# Altium project ADCS ARM.PrjPcb
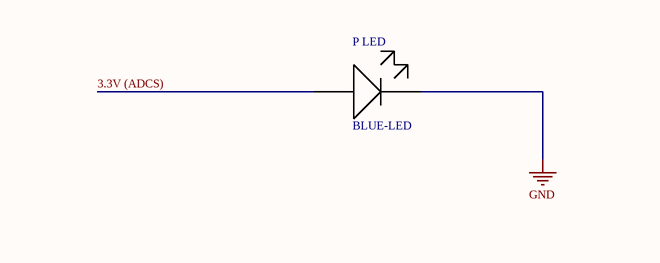
[diagram p0: ADCS ARM.SchDoc, top left]
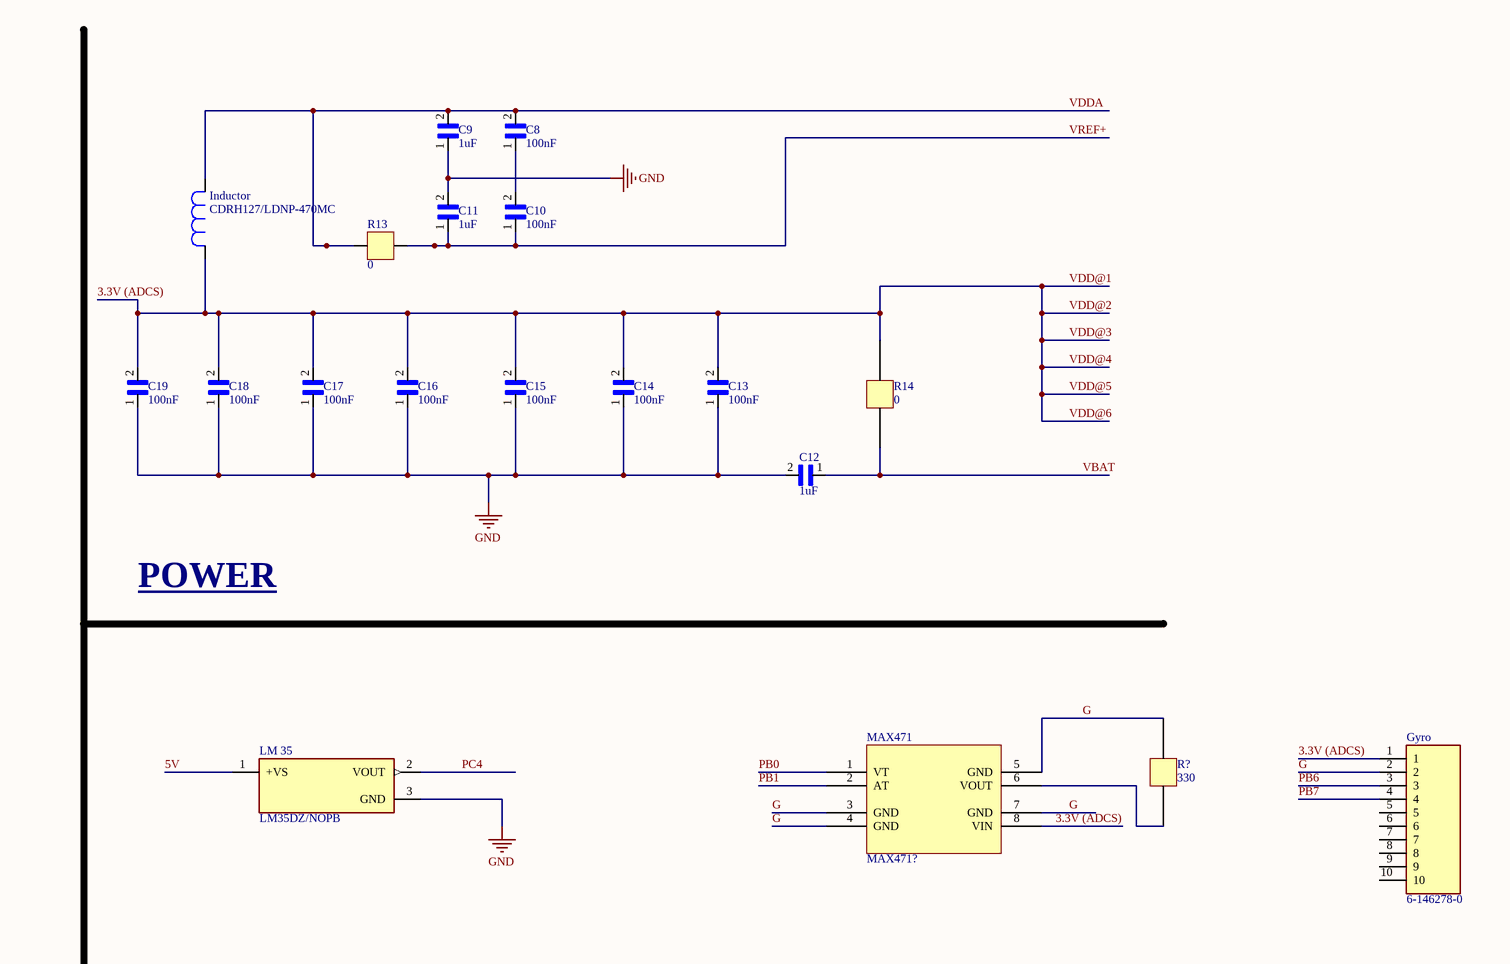
[diagram p1: ADCS ARM.SchDoc, top right]
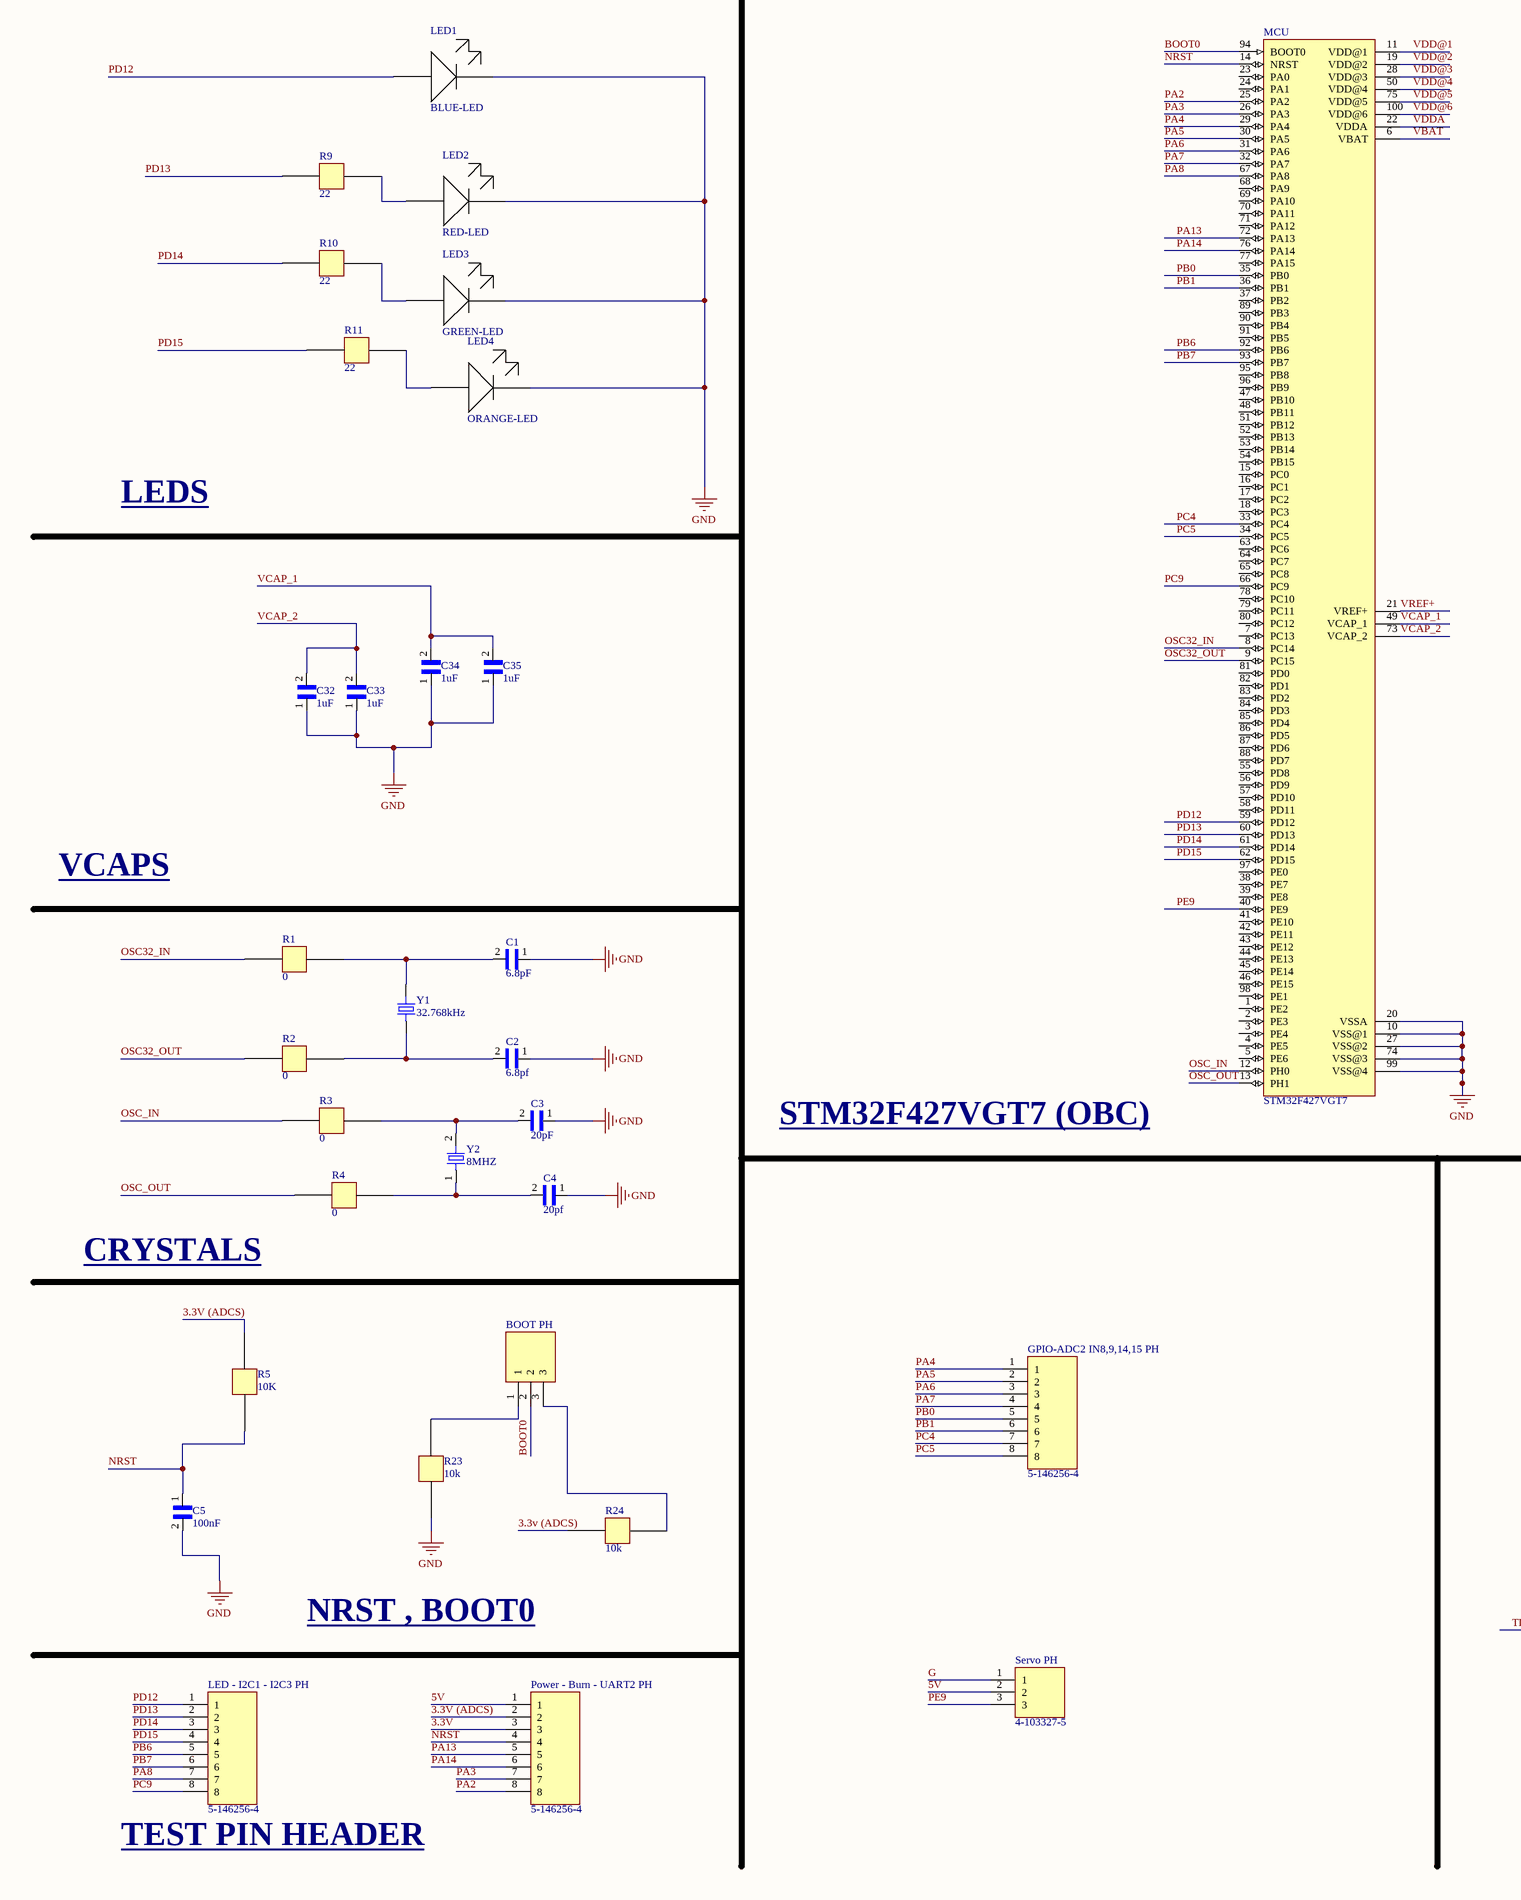
[diagram p2: ADCS ARM.SchDoc, bottom left]
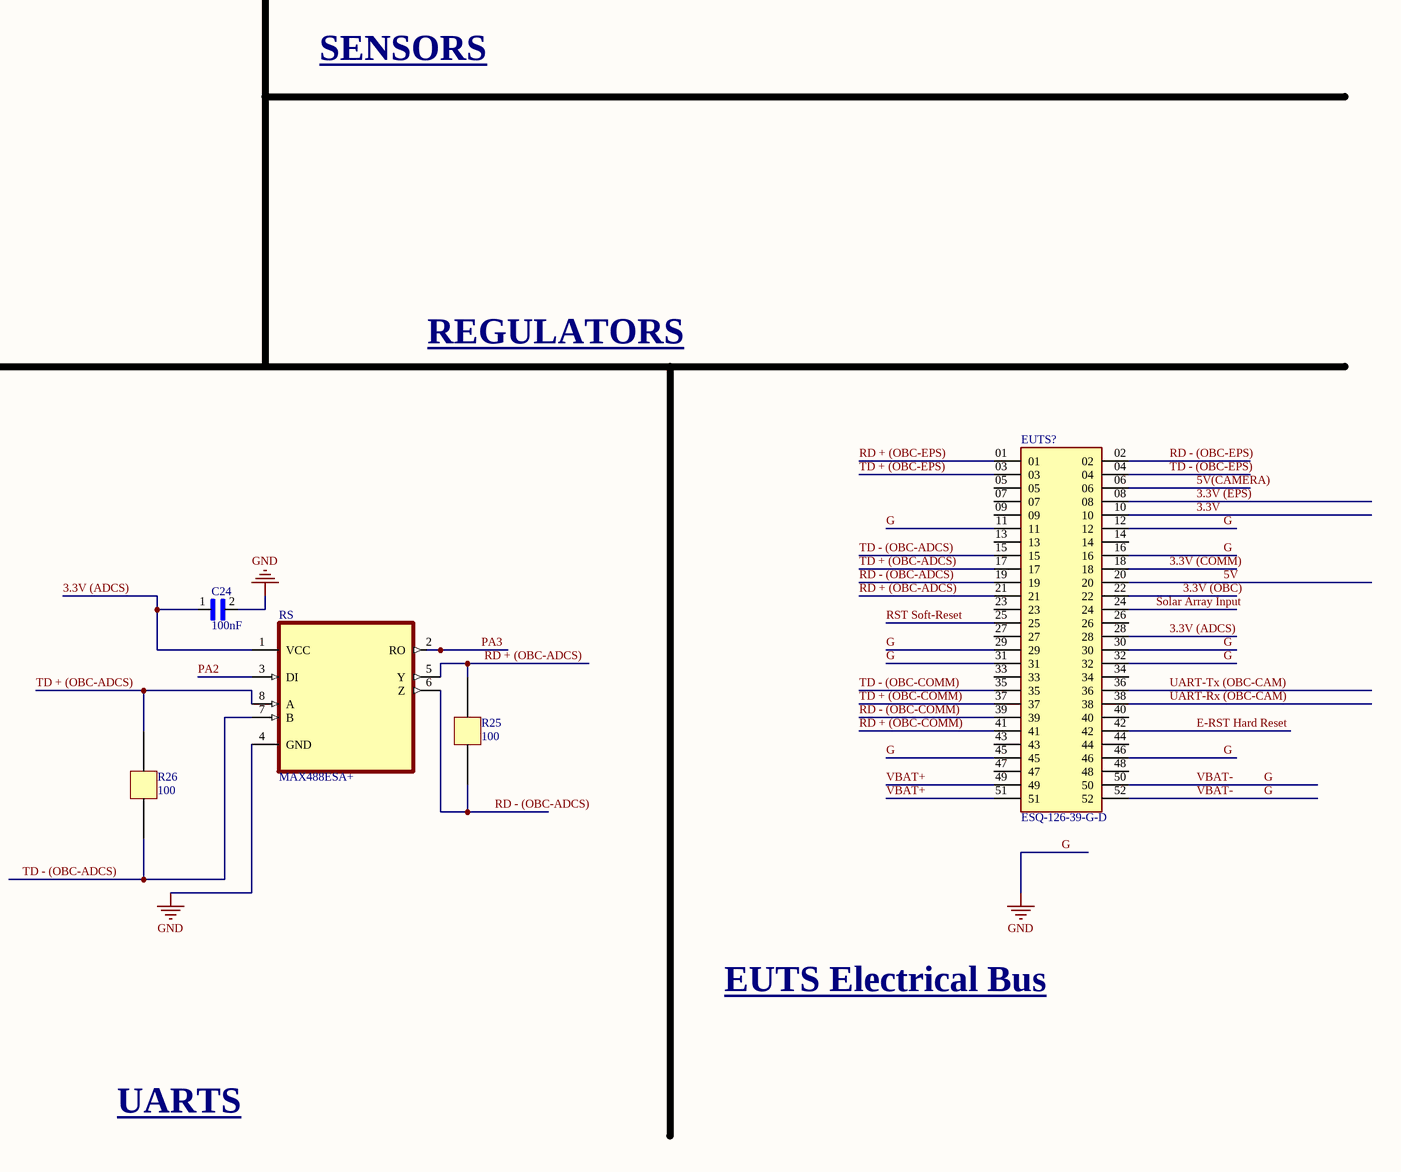
[diagram p3: ADCS ARM.SchDoc, bottom right]
1 sheet, 56 parts. Net scope: global (net labels, ports and power ports of the same name join across sheets).
Board file: ADCS ARM EUTS.PcbDoc

## Sheet ADCS ARM.SchDoc
size A1; SheetNumber: 1; SheetTotal: 1

### Parts
BOOT_PH  4-103327-5  [TE_4-103327-5]  (value not drawn)
C1  6.8pF  [CAPC2012X95N]
C2  6.8pf  [CAPC2012X95N]
C3  20pF  [CAPC2012X95N]
C4  20pf  [CAPC2012X95N]
C5  100nF  [CAPC2012X95N]
C8  100nF  [CAPC2012X95N]
C9  1uF  [CAPC2012X95N]
C10  100nF  [CAPC2012X95N]
C11  1uF  [CAPC2012X95N]
C12  1uF  [CAPC2012X95N]
C13  100nF  [CAPC2012X95N]
C14  100nF  [CAPC2012X95N]
C15  100nF  [CAPC2012X95N]
C16  100nF  [CAPC2012X95N]
C17  100nF  [CAPC2012X95N]
C18  100nF  [CAPC2012X95N]
C19  100nF  [CAPC2012X95N]
C24  100nF  [CAPC2012X95N]
C32  1uF  [CAPC2012X95N]
C33  1uF  [CAPC2012X95N]
C34  1uF  [CAPC2012X95N]
C35  1uF  [CAPC2012X95N]
EUTS?  ESQ-126-39-G-D  [SAMTEC_ESQ-126-39-G-D]
GPIO-ADC2_IN8,9,14,15_PH  5-146256-4  [TE_5-146256-4]
Gyro  6-146278-0  [TE_6-146278-0]
Inductor  CDRH127/LDNP-470MC  [IND_CDRH127/LDNP-470MC_SUM]
LED1  BLUE-LED  [RESC3015X65]
LED2  RED-LED  [RESC3015X65]
LED3  GREEN-LED  [RESC3015X65]
LED4  ORANGE-LED  [RESC3015X65]
LED_-_I2C1_-_I2C3_PH  5-146256-4  [TE_5-146256-4]
LM_35  LM35DZ/NOPB  [TO92127P521H735-3]
MAX471  MAX471?  [PCBComponent_1]
MCU  STM32F427VGT7  [QFP50P1600X1600X160-100N]
P_LED  BLUE-LED  [RESC3015X65]
Power_-_Burn_-_UART2_PH  5-146256-4  [TE_5-146256-4]
R1  0  [CAPC2012X95N]
R2  0  [CAPC2012X95N]
R3  0  [CAPC2012X95N]
R4  0  [CAPC2012X95N]
R5  10K  [CAPC2012X95N]
R9  22  [CAPC2012X95N]
R10  22  [CAPC2012X95N]
R11  22  [CAPC2012X95N]
R13  0  [CAPC2012X95N]
R14  0  [CAPC2012X95N]
R23  10k  [CAPC2012X95N]
R24  10k  [CAPC2012X95N]
R25  100  [CAPC2012X95N]
R26  100  [CAPC2012X95N]
R?  330  [CAPC2012X95N]
RS  MAX488ESA+  [SOIC127P600X175-8N]
Servo_PH  4-103327-5  [TE_4-103327-5]
Y1  32.768kHz  [XTAL_ECS-.327-12.5-34S-TR]
Y2  8MHZ  [XTAL500X320X130N]

### Nets
G: C1.1 C2.1 C3.1 C4.1 C5.2 C9.1 C11.2 C12.2 C13.1 C14.1 C15.1 C16.1 C17.1 C18.1 C19.1 C24.2 C32.1 C33.1 C34.1 C35.1 EUTS?.11 EUTS?.12 EUTS?.16 EUTS?.29 EUTS?.30 EUTS?.31 EUTS?.32 EUTS?.45 EUTS?.46 EUTS?.50 EUTS?.52 Gyro.2 LED1.2 LED2.2 LED3.2 LED4.2 LM_35.3(GND) MAX471.3(GND) MAX471.4(GND) MAX471.5(GND) MAX471.7(GND) MCU.10(VSS@1) MCU.20(VSSA) MCU.27(VSS@2) MCU.74(VSS@3) MCU.99(VSS@4) P_LED.2 R23.2 R?.1 RS.4(GND) Servo_PH.1  [also labelled GND, VBAT-]
3.3V: EUTS?.10 Power_-_Burn_-_UART2_PH.3
3.3V (ADCS): C13.2 C14.2 C15.2 C16.2 C17.2 C18.2 C19.2 C24.1 EUTS?.28 Gyro.1 Inductor.2 MAX471.8(VIN) MCU.11(VDD@1) MCU.19(VDD@2) MCU.28(VDD@3) MCU.50(VDD@4) MCU.75(VDD@5) MCU.100(VDD@6) P_LED.1 Power_-_Burn_-_UART2_PH.2 R5.1 R14.1 R24.2 RS.1(VCC)  [also labelled VDD@1, VDD@2, VDD@3, VDD@4, VDD@5, VDD@6]
3.3V (COMM): EUTS?.18
3.3V (EPS): EUTS?.08
3.3V (OBC): EUTS?.22
5V: EUTS?.20 LM_35.1(+VS) Power_-_Burn_-_UART2_PH.1 Servo_PH.2
5V(CAMERA): EUTS?.06
BOOT0: BOOT_PH.2 MCU.94(BOOT0)
E-RST Hard Reset: EUTS?.42
NRST: C5.1 MCU.14(NRST) Power_-_Burn_-_UART2_PH.4 R5.2
OSC32_IN: MCU.8(PC14) R1.2
OSC32_OUT: MCU.9(PC15) R2.2
OSC_IN: MCU.12(PH0) R3.2
OSC_OUT: MCU.13(PH1) R4.2
PA2: MCU.25(PA2) Power_-_Burn_-_UART2_PH.8 RS.3(DI)
PA3: MCU.26(PA3) Power_-_Burn_-_UART2_PH.7 RS.2(RO)
PA4: GPIO-ADC2_IN8,9,14,15_PH.1 MCU.29(PA4)
PA5: GPIO-ADC2_IN8,9,14,15_PH.2 MCU.30(PA5)
PA6: GPIO-ADC2_IN8,9,14,15_PH.3 MCU.31(PA6)
PA7: GPIO-ADC2_IN8,9,14,15_PH.4 MCU.32(PA7)
PA8: LED_-_I2C1_-_I2C3_PH.7 MCU.67(PA8)
PA13: MCU.72(PA13) Power_-_Burn_-_UART2_PH.5
PA14: MCU.76(PA14) Power_-_Burn_-_UART2_PH.6
PB0: GPIO-ADC2_IN8,9,14,15_PH.5 MAX471.1(VT) MCU.35(PB0)
PB1: GPIO-ADC2_IN8,9,14,15_PH.6 MAX471.2(AT) MCU.36(PB1)
PB6: Gyro.3 LED_-_I2C1_-_I2C3_PH.5 MCU.92(PB6)
PB7: Gyro.4 LED_-_I2C1_-_I2C3_PH.6 MCU.93(PB7)
PC4: GPIO-ADC2_IN8,9,14,15_PH.7 LM_35.2(VOUT) MCU.33(PC4)
PC5: GPIO-ADC2_IN8,9,14,15_PH.8 MCU.34(PC5)
PC9: LED_-_I2C1_-_I2C3_PH.8 MCU.66(PC9)
PD12: LED1.1 LED_-_I2C1_-_I2C3_PH.1 MCU.59(PD12)
PD13: LED_-_I2C1_-_I2C3_PH.2 MCU.60(PD13) R9.2
PD14: LED_-_I2C1_-_I2C3_PH.3 MCU.61(PD14) R10.2
PD15: LED_-_I2C1_-_I2C3_PH.4 MCU.62(PD15) R11.2
PE9: MCU.40(PE9) Servo_PH.3
RD + (OBC-ADCS): EUTS?.21 R25.1 RS.5(Y)
RD + (OBC-COMM): EUTS?.41
RD + (OBC-EPS): EUTS?.01
RD - (OBC-ADCS): EUTS?.19 R25.2 RS.6(Z)
RD - (OBC-COMM): EUTS?.39
RD - (OBC-EPS): EUTS?.02
RST Soft-Reset: EUTS?.25
Solar Array Input: EUTS?.24
TD + (OBC-ADCS): EUTS?.17 R26.1 RS.8(A)
TD + (OBC-COMM): EUTS?.37
TD + (OBC-EPS): EUTS?.03
TD - (OBC-ADCS): EUTS?.15 R26.2 RS.7(B)
TD - (OBC-COMM): EUTS?.35
TD - (OBC-EPS): EUTS?.04
UART-Rx (OBC-CAM): EUTS?.38
UART-Tx (OBC-CAM): EUTS?.36
VBAT: C12.1 MCU.6(VBAT) R14.2
VBAT+: EUTS?.49 EUTS?.51
VCAP_1: C34.2 C35.2 MCU.49(VCAP_1)
VCAP_2: C32.2 C33.2 MCU.73(VCAP_2)
VDDA: C8.2 C9.2 Inductor.1 MCU.22(VDDA) R13.2
VREF+: C10.1 C11.1 MCU.21(VREF+) R13.1
NetBOOT_PH_1: BOOT_PH.1 R23.1
NetBOOT_PH_3: BOOT_PH.3 R24.1
NetC1_2: C1.2 R1.1 Y1.2(OUT/IN)
NetC2_2: C2.2 R2.1 Y1.1(IN/OUT)
NetC3_2: C3.2 R3.1 Y2.2
NetC4_2: C4.2 R4.1 Y2.1
NetC8_1: C8.1 C10.2
NetLED2_1: LED2.1 R9.1
NetLED3_1: LED3.1 R10.1
NetLED4_1: LED4.1 R11.1
NetMAX471_6: MAX471.6(VOUT) R?.2

Not connected (* = marked no-connect by the designer): EUTS? 05 07 09 13 14 23 26 27 33 34 40 43 44 47 48; Gyro 5 6 7 8 9 10; MCU 1(PE2) 2(PE3) 3(PE4) 4(PE5) 5(PE6) 7(PC13) 15(PC0) 16(PC1) 17(PC2) 18(PC3) 23(PA0) 24(PA1) 37(PB2) 38(PE7) 39(PE8) 41(PE10) 42(PE11) 43(PE12) 44(PE13) 45(PE14) 46(PE15) 47(PB10) 48(PB11) 51(PB12) 52(PB13) 53(PB14) 54(PB15) 55(PD8) 56(PD9) 57(PD10) 58(PD11) 63(PC6) 64(PC7) 65(PC8) 68(PA9) 69(PA10) 70(PA11) 71(PA12) 77(PA15) 78(PC10) 79(PC11) 80(PC12) 81(PD0) 82(PD1) 83(PD2) 84(PD3) 85(PD4) 86(PD5) 87(PD6) 88(PD7) 89(PB3) 90(PB4) 91(PB5) 95(PB8) 96(PB9) 97(PE0) 98(PE1)

### Notes on the sheet
- LEDS
- POWER
- VCAPS
- SENSORS
- STM32F427VGT7 (OBC)
- REGULATORS
- CRYSTALS
- NRST , BOOT0
- EUTS Electrical Bus
- (near LED_-_I2C1_-_I2C3_PH) TEST PIN HEADER
- UARTS

### Library data of the parts
BOOT_PH Servo_PH = 4-103327-5: Conn Unshrouded Header HDR 3 POS 2.54mm Solder ST Thru-Hole Carton; MF: TE Connectivity; Package: None; Value: *; TE_purchase_URL: https://www.te.com/usa-en/product-4-103327-5.html?te_bu=Cor&te_type=disp&te_campaign=seda_glo_cor-seda-global-disp-prtnr-fy19-seda-model-bom-cta_sma-317_1&elqCampaignId=32493; Price: None; MP: 4-103327-5; SnapEDA_Link: https://www.snapeda.com/parts/4-103327-5/TE%20Connectivity%20AMP%20Connectors/view-part/2403997/?ref=snap; Availability: Unavailable; EU_RoHS_Compliance: Compliant
C1-C5 C8-C19 C24 C32-C35 = UMK212SD103KD-T: CAP CER 10000PF 50V 0805; Package: None; Price: None; Value: *; MP: UMK212SD103KD-T; Availability: Unavailable
EUTS? = ESQ-126-39-G-D: 52 Position Elevated Socket Connector Through Hole; MF: Samtec; Package: None; MP: ESQ-126-39-G-D; Value: *; Availability: Unavailable; Price: None; SnapEDA_Link: https://www.snapeda.com/parts/ESQ-126-39-G-D/Samtec%20Inc./view-part/490181/?ref=snap
GPIO-ADC2_IN8,9,14,15_PH LED_-_I2C1_-_I2C3_PH Power_-_Burn_-_UART2_PH = 5-146256-4: 08 MODII HDR DRST B/A .100CL LF; MF: TE Connectivity; Package: None; Availability: Unavailable; Value: *; MP: 5-146256-4; Price: None; SnapEDA_Link: https://www.snapeda.com/parts/5-146256-4/TE%20Connectivity%20AMP%20Connectors/view-part/500529/?ref=snap
Gyro = 6-146278-0: 10 MODII HDR SRST B/A .100CL; Number_of_Positions: 10; MF: TE Connectivity; Centerline_Pitch: 2.54 mm[.1 in]; Product_Type: Connector; SnapEDA_Link: https://www.snapeda.com/parts/6-146278-0/TE%20Connectivity/view-part/1405716/?ref=snap; Price: None; Purchase-URL: https://pricing.snapeda.com/search/part/6-146278-0/?ref=eda; EU_RoHS_Compliance: Compliant; MP: 6-146278-0; Value: *; Availability: Warning; Package: None; Check_prices: https://www.snapeda.com/parts/6-146278-0/TE%20Connectivity/view-part/1405716/?ref=eda
Inductor = CDRH127/LDNP-470MC: 47ÂµH Shielded Inductor 3.25A 78mOhm Max Nonstandard; MF: Sumida America; Digi-Key_Part_Number: 308-1339-1-ND; Check_prices: https://www.snapeda.com/parts/CDRH127/LDNP-470MC/Sumida%20America%20Components%20Inc./view-part/547921/?ref=eda; Package: Nonstandard Sumida; Value: *; MP: CDRH127/LDNP-470MC; SnapEDA_Link: https://www.snapeda.com/parts/CDRH127/LDNP-470MC/Sumida%20America%20Components%20Inc./view-part/547921/?ref=snap; Purchase-URL: https://pricing.snapeda.com/search/part/CDRH127/LDNP-470MC/?ref=eda
LED1-LED4 P_LED = LTST-C150TBKT: LED Blue 470nm LED Indication 3.3V
LM_35 = LM35DZ/NOPB: Temperature Sensor Analog, Local 0Â°C ~ 100Â°C 10mV/Â°C TO-92-3; MF: Texas Instruments; MP: LM35DZ; Value: *; SnapEDA_Link: https://www.snapeda.com/parts/LM35DZ/Texas+Instruments/view-part/?ref=snap; Price: None; Availability: Not in stock; Package: E-PKG AXIAL-LEADED-2 ON Semiconductor; Check_prices: https://www.snapeda.com/parts/LM35DZ/Texas+Instruments/view-part/?ref=eda
MAX471 = MAX471?: MAX471 Voltage And Current Sensor Module Consume Voltage Load Detection Module
MCU = STM32F427VGT7: ARMÂ® CortexÂ®-M4 STM32F4 Microcontroller IC 32-Bit 180MHz 1MB _1M x 8_ FLASH 100-LQFP _14x14_; MF: STMicroelectronics; Package: LQFP-100 STMicroelectronics; Availability: Unavailable; Value: *; MP: STM32F427VGT7; SnapEDA_Link: https://www.snapeda.com/parts/STM32F427VGT7/STMicroelectronics/view-part/567621/?ref=snap; Price: None
R1-R5 R9-R11 R13 R14 R23-R26 R? = RESISTOR
RS = MAX488ESA+: 1/1 Transceiver Full RS422, RS485 8-SOIC; MP: MAX488ESA+T; MF: Maxim Integrated; Price: None; Package: SOIC-8 Maxim; Availability: Unavailable; SnapEDA_Link: https://www.snapeda.com/parts/MAX488ESA+T/Maxim%20Integrated/view-part/48834/?ref=snap; Value: *
Y1 = ECS-.327-12.5-34S-TR: 32.768kHz Â±20ppm Crystal 12.5pF 70 kOhms 2-SMD, No Lead; MF: ECS Inc.; MP: ECS-.327-12.5-34S-TR; Value: *; Availability: Unavailable; SnapEDA_Link: https://www.snapeda.com/parts/ECS-.327-12.5-34S-TR/ECS%20Inc./view-part/2454548/?ref=snap; Price: None; Package: SMD-2 ECS International
Y2 = ABM3-8.000MHZ-D2Y-T: 8MHz Â±20ppm Crystal 18pF 140 Ohms 2-SMD, No Lead; MF: Abracon; Value: *; MP: ABM3-8.000MHZ-D2Y-T; SnapEDA_Link: https://www.snapeda.com/parts/ABM3-8.000MHZ-D2Y-T/Abracon%20LLC/view-part/106372/?ref=snap; Package: SMD-2 Abracon; Digi-Key_Part_Number: 535-10630-1-ND; Digi-Key_Purchase_URL: https://www.digikey.com/product-detail/en/abracon-llc/ABM3-8.000MHZ-D2Y-T/535-10630-1-ND/2344632?utm_source=snapeda&utm_medium=aggregator&utm_campaign=symbol